# EAGLE schematic esp32-thing (EAGLE 7.3.0)
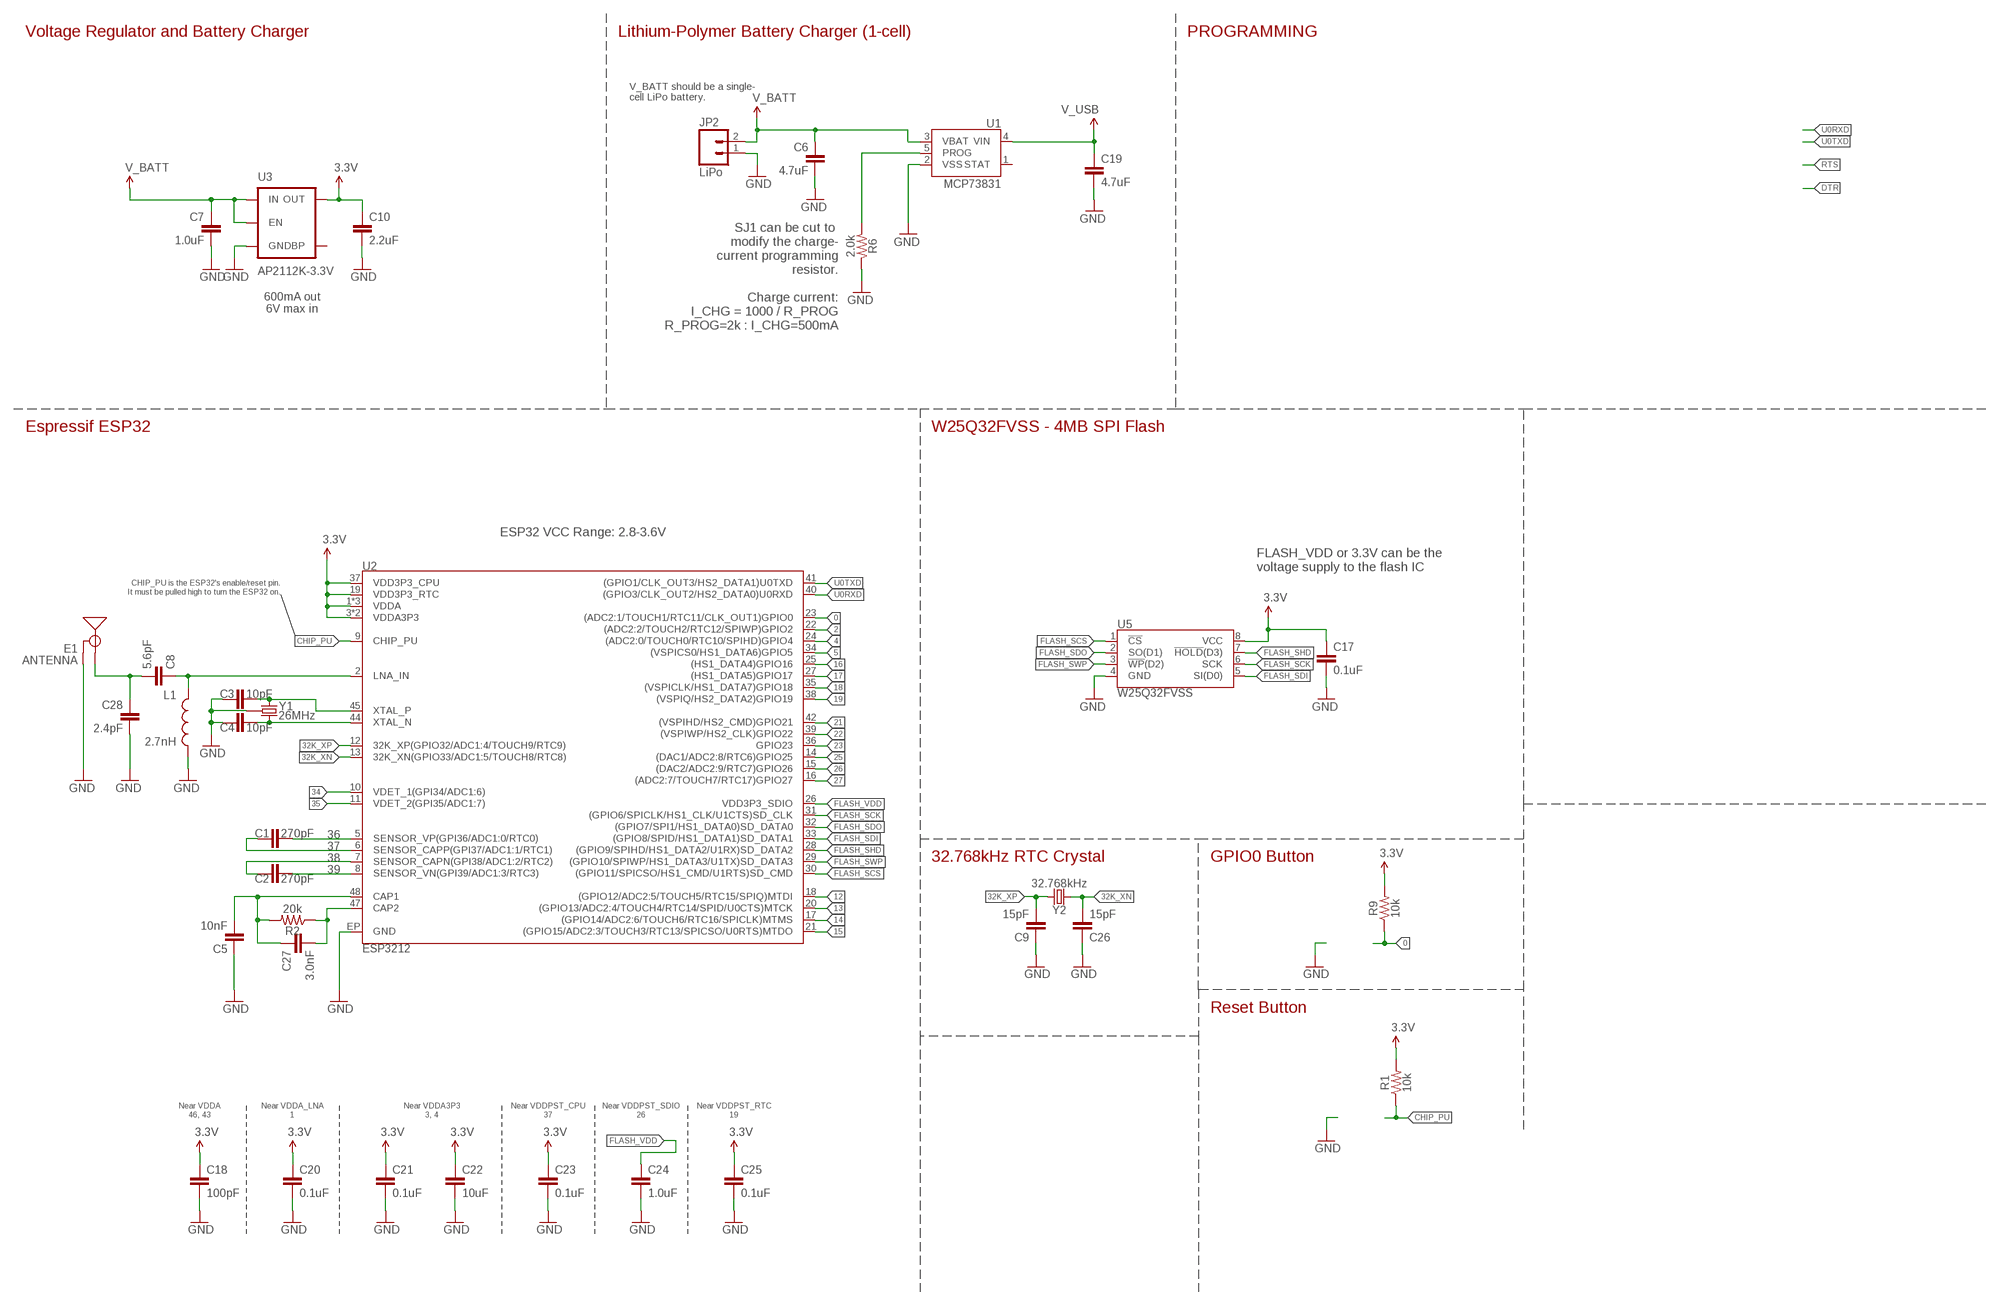
[diagram p0: schematic, sheet 1]

## Parts
C1  270pF  270PF-50V-5%(0603)  [0603]
C2  270pF  270PF-50V-5%(0603)  [0603]
C3  10pF  10PF-0603-50V-5%  [0603]
C4  10pF  10PF-0603-50V-5%  [0603]
C5  10nF  10NF-0603-50V-10%  [0603]
C6  4.7uF  4.7UF0603  [0603]
C7  1.0uF  1.0UF-0805-25V-(+80/-20%)  [0805]
C8  5.6pF  5.6PF-50V-5%(0603)  [0603]
C9  15pF  15PF-0603-50V-5%  [0603]
C10  2.2uF  2.2UF-0603-10V-20%  [0603]
C17  0.1uF  0.1UF-0603-25V-(+80/-20%)  [0603]
C18  100pF  100PF-0603-50V-5%  [0603]
C19  4.7uF  4.7UF0603  [0603]
C20  0.1uF  0.1UF-0603-25V-(+80/-20%)  [0603]
C21  0.1uF  0.1UF-0603-25V-(+80/-20%)  [0603]
C22  10uF  10UF-0603-6.3V-20%  [0603]
C23  0.1uF  0.1UF-0603-25V-(+80/-20%)  [0603]
C24  1.0uF  1.0UF-0603-16V-10%  [0603]
C25  0.1uF  0.1UF-0603-25V-(+80/-20%)  [0603]
C26  15pF  15PF-0603-50V-5%  [0603]
C27  3.0nF  3.0NF-0603-50V-5%  [0603]
C28  2.4pF  2.4PF-0603-50V-5%  [0603]
E1  ANTENNA  ANTENNATRACE-TUNED  [TRACE_ANTENNA_2.4GHZ_25.7MM_TUNED]
JP2  LiPo  M02JST-PTH-2  [JST-2-PTH]
L1  2.7nH  INDUCTOR0603  [0603]
R1  10k  10KOHM-1/10W-1%(0603)0603  [0603]
R2  20k  20KOHM-0603-1/10W-1%  [0603]
R6  2.0k  2.0KOHM1/10W5%(0603)  [0603]
R9  10k  10KOHM-1/10W-1%(0603)0603  [0603]
U1  MCP73831  [SOT23-5]
U2  ESP3212  [QFN48-0.4MM]
U3  AP2112K-3.3V  V_REG_LDOSMD  [SOT23-5]
U5  W25Q32FVSS  [SOIC-8]
Y1  26MHz  CRYSTAL-GROUNDED3.2X2.5  [CRYSTAL-SMD-3.2X2.5]
Y2  32.768kHz  CRYSTAL-32.768KHZSMD-3.2X1.5  [CRYSTAL-SMD-3.2X1.5MM]

## Nets
0: R9.1 U2.23((ADC2:1/TOUCH1/RTC11/CLK_OUT1)GPIO0)
2: U2.22((ADC2:2/TOUCH2/RTC12/SPIWP)GPIO2)
3.3V: C10.1 C17.1 C18.1 C20.1 C21.1 C22.1 C23.1 C25.1 R1.2 R9.2 U2.1(VDDA) U2.3(VDDA3P3) U2.4(VDDA3P3) U2.19(VDD3P3_RTC) U2.37(VDD3P3_CPU) U2.43(VDDA) U2.46(VDDA) U3.5(OUT) U5.8(VCC)
4: U2.24((ADC2:0/TOUCH0/RTC10/SPIHD)GPIO4)
5: U2.34((VSPICS0/HS1_DATA6)GPIO5)
12: U2.18((GPIO12/ADC2:5/TOUCH5/RTC15/SPIQ)MTDI)
13: U2.20((GPIO13/ADC2:4/TOUCH4/RTC14/SPID/U0CTS)MTCK)
14: U2.17((GPIO14/ADC2:6/TOUCH6/RTC16/SPICLK)MTMS)
15: U2.21((GPIO15/ADC2:3/TOUCH3/RTC13/SPICSO/U0RTS)MTDO)
16: U2.25((HS1_DATA4)GPIO16)
17: U2.27((HS1_DATA5)GPIO17)
18: U2.35((VSPICLK/HS1_DATA7)GPIO18)
19: U2.38((VSPIQ/HS2_DATA2)GPIO19)
21: U2.42((VSPIHD/HS2_CMD)GPIO21)
22: U2.39((VSPIWP/HS2_CLK)GPIO22)
23: U2.36(GPIO23)
25: U2.14((DAC1/ADC2:8/RTC6)GPIO25)
26: U2.15((DAC2/ADC2:9/RTC7)GPIO26)
27: U2.16((ADC2:7/TOUCH7/RTC17)GPIO27)
32K_XN: C26.2 U2.13(32K_XN(GPIO33/ADC1:5/TOUCH8/RTC8)) Y2.P$2
32K_XP: C9.2 U2.12(32K_XP(GPIO32/ADC1:4/TOUCH9/RTC9)) Y2.P$1
34: U2.10(VDET_1(GPI34/ADC1:6))
35: U2.11(VDET_2(GPI35/ADC1:7))
36: C1.2 U2.5(SENSOR_VP(GPI36/ADC1:0/RTC0))
37: C1.1 U2.6(SENSOR_CAPP(GPI37/ADC1:1/RTC1))
38: C2.1 U2.7(SENSOR_CAPN(GPI38/ADC1:2/RTC2))
39: C2.2 U2.8(SENSOR_VN(GPI39/ADC1:3/RTC3))
CAP_10N: C5.2 C27.1 R2.2 U2.48(CAP1)
CHIP_PU: R1.1 U2.9(CHIP_PU)
FLASH_SCK: U2.31((GPIO6/SPICLK/HS1_CLK/U1CTS)SD_CLK) U5.6(SCK)
FLASH_SCS: U2.30((GPIO11/SPICSO/HS1_CMD/U1RTS)SD_CMD) U5.1(!CS!)
FLASH_SDI: U2.33((GPIO8/SPID/HS1_DATA1)SD_DATA1) U5.5(SI(D0))
FLASH_SDO: U2.32((GPIO7/SPI1/HS1_DATA0)SD_DATA0) U5.2(SO(D1))
FLASH_SHD: U2.28((GPIO9/SPIHD/HS1_DATA2/U1RX)SD_DATA2) U5.7(!HOLD!(D3))
FLASH_SWP: U2.29((GPIO10/SPIWP/HS1_DATA3/U1TX)SD_DATA3) U5.3(!WP!(D2))
FLASH_VDD: C24.1 U2.26(VDD3P3_SDIO)
GND: C3.1 C4.1 C5.1 C6.2 C7.2 C9.1 C10.2 C17.2 C18.2 C19.2 C20.2 C21.2 C22.2 C23.2 C24.2 C25.2 C26.1 C28.2 E1.GND E1.GND2(GND) JP2.1 L1.2 R6.1 U1.2(VSS) U2.EP(GND) U3.2(GND) U5.4(GND) Y1.2(GND) Y1.4(GND)
LNA_IN: C8.1 L1.1 U2.2(LNA_IN)
N$4: C27.2 R2.1 U2.47(CAP2)
N$13: C3.2 U2.45(XTAL_P) Y1.1
N$14: R6.2 U1.5(PROG)
N$15: C4.2 U2.44(XTAL_N) Y1.3
TRACE_ANT: C8.2 C28.1 E1.ANT(SIGNAL)
U0RXD: U2.40((GPIO3/CLK_OUT2/HS2_DATA0)U0RXD)
U0TXD: U2.41((GPIO1/CLK_OUT3/HS2_DATA1)U0TXD)
V_BATT: C6.1 C7.1 JP2.2 U1.3(VBAT) U3.1(IN) U3.3(EN)
V_USB: C19.1 U1.4(VIN)
Unconnected: U1.1(STAT) U3.4(BP)

## Notes on the sheet
- Voltage Regulator and Battery Charger | Lithium-Polymer Battery Charger (1-cell) | PROGRAMMING
- V_BATT should be a single-
  cell LiPo battery.
- SJ1 can be cut to 
  modify the charge-
  current programming
  resistor.
- 600mA out
  6V max in
- Charge current:
  I_CHG = 1000 / R_PROG
  R_PROG=2k : I_CHG=500mA
- Espressif ESP32 | W25Q32FVSS - 4MB SPI Flash
- ESP32 VCC Range: 2.8-3.6V
- FLASH_VDD or 3.3V can be the
  voltage supply to the flash IC
- CHIP_PU is the ESP32's enable/reset pin.
  It must be pulled high to turn the ESP32 on.
- 32.768kHz RTC Crystal | GPIO0 Button
- Reset Button
- Near VDDA
  46, 43
- Near VDDA_LNA
  1
- Near VDDA3P3
  3, 4
- Near VDDPST_CPU
  37
- Near VDDPST_SDIO
  26
- Near VDDPST_RTC
  19

## Library data of the parts
C1 C2 = esp32-thing-temp:270PF-50V-5%(0603): CAP-13339; PROD_ID: CAP-13339
C3 C4 = SparkFun-Capacitors:10PF: 10pF ceramic capacitors A capacitor is a passive two-terminal electrical component used to store electrical energy temporarily in an electric field.; PROD_ID: CAP-11812
C5 = SparkFun-Capacitors:10NF: 0.01uF/10nF/10,000pF ceramic capacitors A capacitor is a passive two-terminal electrical component used to store electrical energy temporarily in an electric field. CAP-09321; PROD_ID: CAP-00867
C6 C19 = SparkFun-Capacitors:4.7UF: 4.7µF ceramic capacitors A capacitor is a passive two-terminal electrical component used to store electrical energy temporarily in an electric field.; PROD_ID: CAP-08280
C7 = SparkFun-Capacitors:1.0UF: 1µF ceramic capacitors A capacitor is a passive two-terminal electrical component used to store electrical energy temporarily in an electric field.; PROD_ID: CAP-11625
C8 = esp32-thing-temp:5.6PF-50V-5%(0603): CAP-12456; PROD_ID: CAP-12456
C9 C26 = SparkFun-Capacitors:15PF: 15pF ceramic capacitors A capacitor is a passive two-terminal electrical component used to store electrical energy temporarily in an electric field.; PROD_ID: CAP-07881
C10 = SparkFun-Capacitors:2.2UF: 2.2µF ceramic capacitors A capacitor is a passive two-terminal electrical component used to store electrical energy temporarily in an electric field.; PROD_ID: CAP-07888
C17 C20 C21 C23 C25 = SparkFun-Capacitors:0.1UF: 0.1µF ceramic capacitors A capacitor is a passive two-terminal electrical component used to store electrical energy temporarily in an electric field.; PROD_ID: CAP-00810
C18 = SparkFun-Capacitors:100PF: 100pF/0.1nF ceramic capacitors A capacitor is a passive two-terminal electrical component used to store electrical energy temporarily in an electric field.; PROD_ID: CAP-07883
C22 = SparkFun-Capacitors:10UF: 10.0µF ceramic capacitors A capacitor is a passive two-terminal electrical component used to store electrical energy temporarily in an electric field.; PROD_ID: CAP-11015
C24 = SparkFun-Capacitors:1.0UF: 1µF ceramic capacitors A capacitor is a passive two-terminal electrical component used to store electrical energy temporarily in an electric field.; PROD_ID: CAP-00868
C27 = esp32-thing-temp:3.0NF: 3.0nF (3nF, 3000pF) ceramic capacitors A capacitor is a passive two-terminal electrical component used to store electrical energy temporarily in an electric field.; PROD_ID: CAP-13515
C28 = esp32-thing-temp:2.4PF: 2.4pF ceramic capacitors A capacitor is a passive two-terminal electrical component used to store electrical energy temporarily in an electric field.; PROD_ID: CAP-13541
E1 = esp32-thing-temp:ANTENNA: Chip antenna Chip antenna with ground or secondary connection. Common with larger metal RF connectors.
JP2 = SparkFun-Connectors:M02: Standard 2-pin 0.1" header. Use with - straight break away headers ( PRT-00116) - right angle break away headers (PRT-00553) - swiss pins (PRT-00743) - machine pins (PRT-00117) - female headers (PRT-00115) Molex polarized connector foot print use with: PRT-08233 with associated crimp pins and housings. 2.54_SCREWTERM for use with PRT-10571. 3.5mm Screw Terminal footprints for PRT-08084 5mm Screw Terminal footprints for use with PRT-08432; PROD_ID: CONN-09863; SKU: PRT-09914
L1 = SparkFun-Passives:INDUCTOR: Inductors Basic Inductor/Choke - 0603 and 1206. Footprints are not proven and vary greatly between part numbers. INDUCTOR POWER 3.3UH 4.0A SMD 0.197" L x 0.197" W x 0.177" H (5.00mm x 5.00mm x 4.50mm); PROD_ID: NDUC-08762
R1 R9 = SparkFun-Resistors:10KOHM-1/10W-1%(0603): RES-00824; PROD_ID: RES-00824; VALUE: 10K
R2 = SparkFun-Resistors:20KOHM: 20kΩ resistor A resistor is a passive two-terminal electrical component that implements electrical resistance as a circuit element. Resistors act to reduce current flow, and, at the same time, act to lower voltage levels within circuits. - Wikipedia; PROD_ID: RES-09383
R6 = SparkFun-Resistors:2.0KOHM1/10W5%(0603): RES-08296; PROD_ID: RES-08296
U1 = SparkFun-PowerIC:MCP73831: Miniature single cell, fully integrated Li-Ion, Li-polymer charge management controller http://ww1.microchip.com/downloads/en/DeviceDoc/20001984g.pdf IC-09995; PROD_ID: IC-09995
U2 = esp32-thing-temp:ESP3212; PROD_ID: IC-13338
U3 = SparkFun-PowerIC:V_REG_LDO: Voltage Regulator LDO Standard 150mA LDO voltage regulator in SOT-23 layout. Micrel part MIC5205. BP (by-pass) pin is used to lower output noise with 470pF cap.; PROD_ID: VREG-12457
U5 = SparkFun-DigitalIC:W25Q32FV: Winbond W25Q32FV 32Mbit (4MB) Flash The W25Q32FV support the standard Serial Peripheral Interface (SPI), Dual/Quad I/O SPI as well as 2-clocks instruction cycle Quad Peripheral Interface (QPI). Datasheet <http://www.winbond.com/resource-files/w25q32fv%20revh%20091613.pdf>; PROD_ID: IC-13229
Y1 = things:CRYSTAL-GROUNDED; PROD_ID: XTAL-12454
Y2 = SparkFun-Clocks:CRYSTAL-32.768KHZ: 32.768kHz Crystal Frequency: 32.768kHz Frequency Stability: ±20ppm Load Capacitance: 12.5pF (PTH-2X6 & SMD-3.2X1.5), 6pF (SMD-2X6); PROD_ID: XTAL-13062